# EAGLE schematic demo1 (EAGLE 4.16)
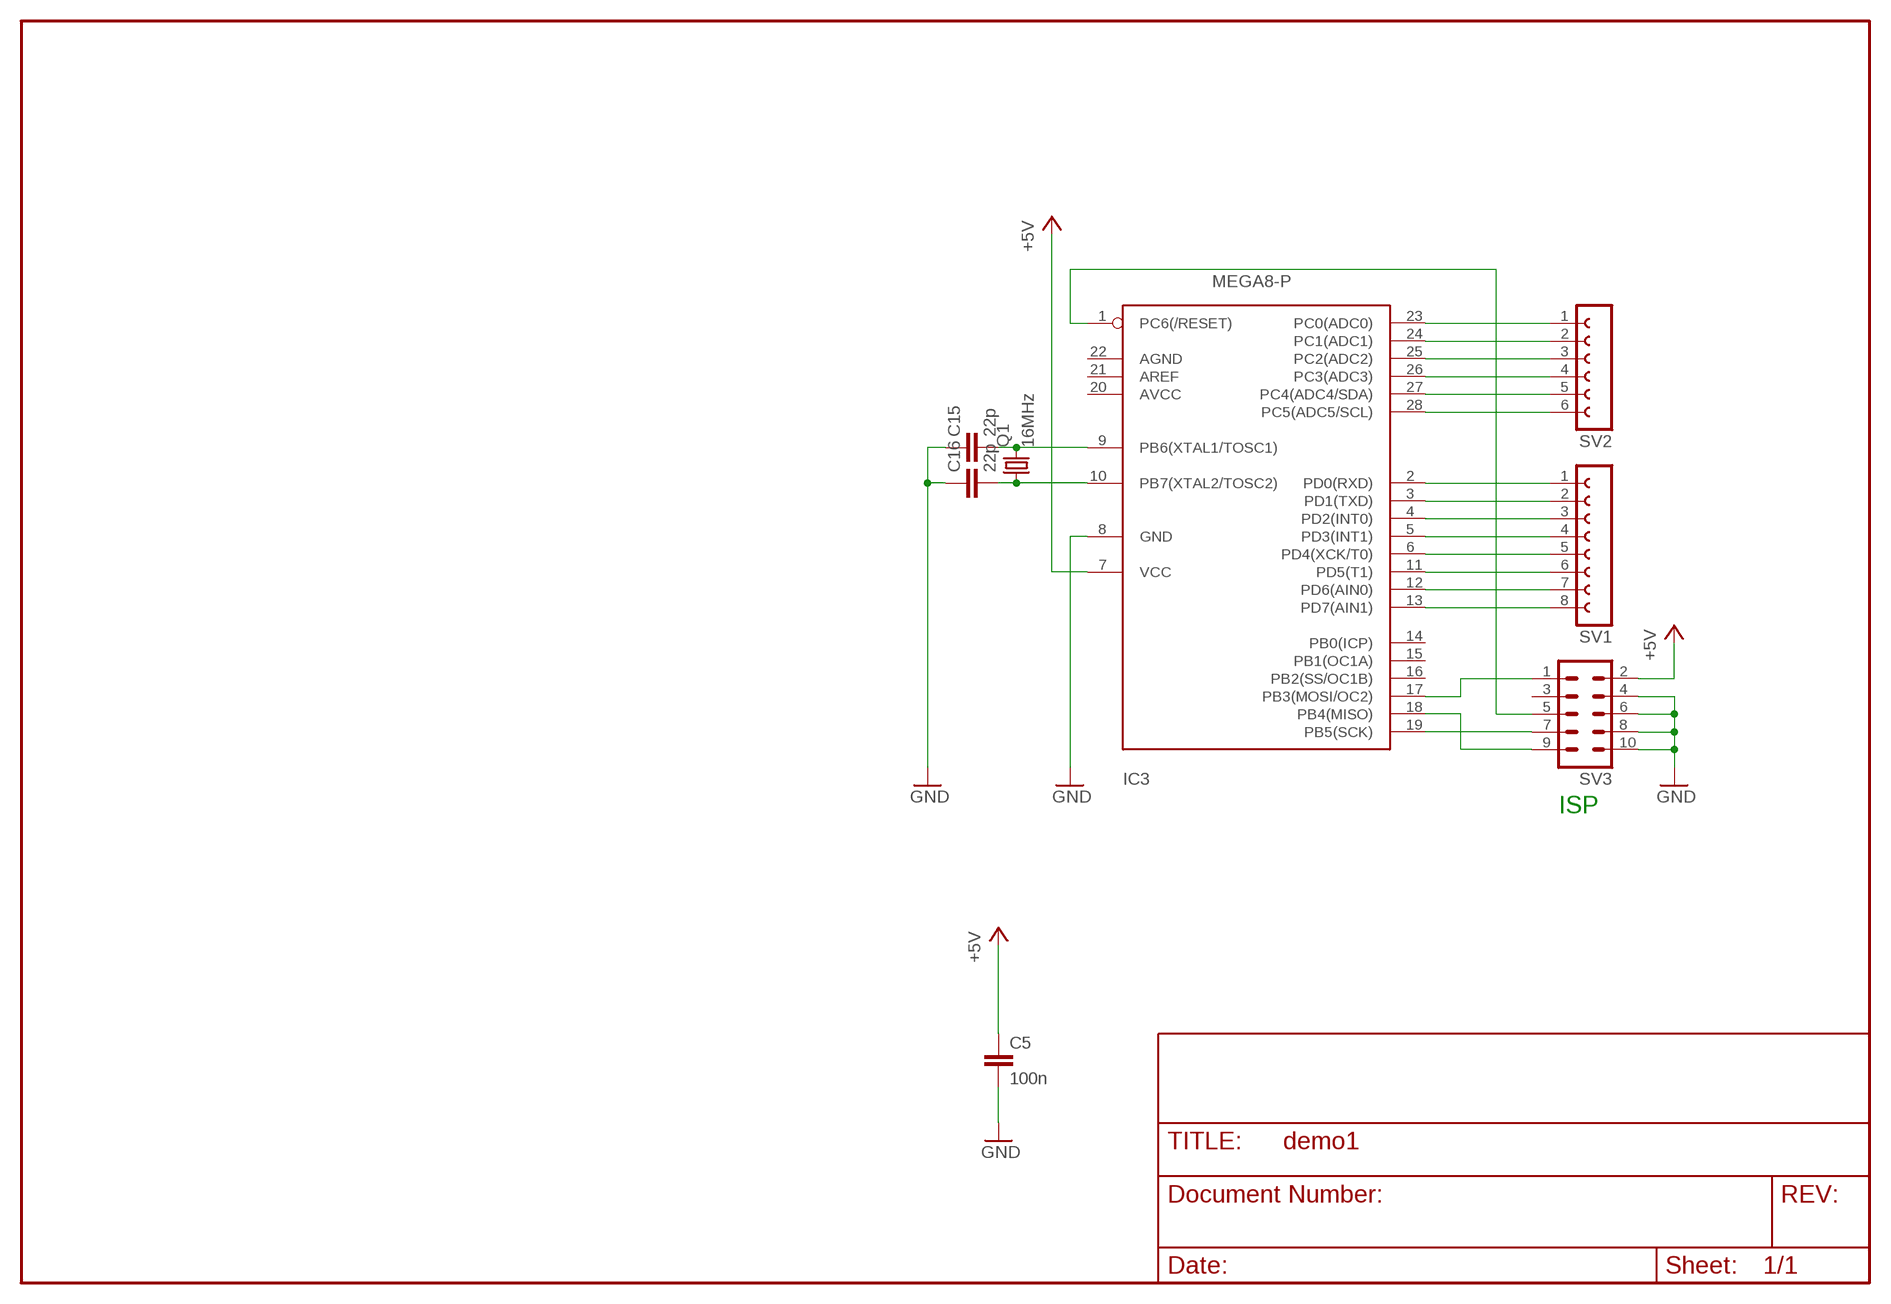
[diagram p0: schematic, sheet 1]

## Parts
C5  100n  C-EU025-025X050  [C025-025X050]
C15  22p  C-EU025-024X044  [C025-024X044]
C16  22p  C-EU025-024X044  [C025-024X044]
IC3  MEGA8-P  [DIL28-3]
Q1  16MHz  CRYTALHC49S  [HC49/S]
SV1  FE08-1  [FE08]
SV2  FE06-1  [FE06]
SV3  ML10  [ML10]

## Nets
+5V: C5.1 IC3.7(VCC) SV3.2
GND: C5.2 C15.1 C16.1 IC3.8(GND) SV3.4 SV3.6 SV3.8 SV3.10
N$3: IC3.2(PD0(RXD)) SV1.1
N$4: IC3.1(PC6(/RESET)) SV3.5
N$5: IC3.3(PD1(TXD)) SV1.2
N$6: IC3.4(PD2(INT0)) SV1.3
N$7: IC3.5(PD3(INT1)) SV1.4
N$8: IC3.6(PD4(XCK/T0)) SV1.5
N$9: IC3.11(PD5(T1)) SV1.6
N$10: IC3.12(PD6(AIN0)) SV1.7
N$11: IC3.13(PD7(AIN1)) SV1.8
N$12: IC3.23(PC0(ADC0)) SV2.1
N$13: IC3.24(PC1(ADC1)) SV2.2
N$14: IC3.19(PB5(SCK)) SV3.7
N$15: IC3.18(PB4(MISO)) SV3.9
N$16: IC3.25(PC2(ADC2)) SV2.3
N$17: IC3.26(PC3(ADC3)) SV2.4
N$18: IC3.27(PC4(ADC4/SDA)) SV2.5
N$19: IC3.28(PC5(ADC5/SCL)) SV2.6
N$22: C15.2 IC3.9(PB6(XTAL1/TOSC1)) Q1.2
N$23: C16.2 IC3.10(PB7(XTAL2/TOSC2)) Q1.1
N$31: IC3.17(PB3(MOSI/OC2)) SV3.1
Unconnected: IC3.14(PB0(ICP)) IC3.15(PB1(OC1A)) IC3.16(PB2(SS/OC1B)) IC3.20(AVCC) IC3.21(AREF) IC3.22(AGND) SV3.3

## Notes on the sheet
- ISP

## Library data of the parts
C5 C15 C16 = rcl:C-EU: CAPACITOR, European symbol
IC3 = atmel2:MEGA8-P: MICROCONTROLLER 8 Kbytes FLASH 1 kbytes SRAM 512 bytes EEPROM USART 4-channel 10 bit ADC 2-channel 8 bit ADC
Q1 = crystal:CRYTAL: CRYSTAL
SV1 = con-lsta:FE08-1: FEMALE HEADER
SV2 = con-lsta:FE06-1: FEMALE HEADER
SV3 = con-harting-ml:ML10: HARTING